# Altium project AgroRak_MK2.PrjPcb
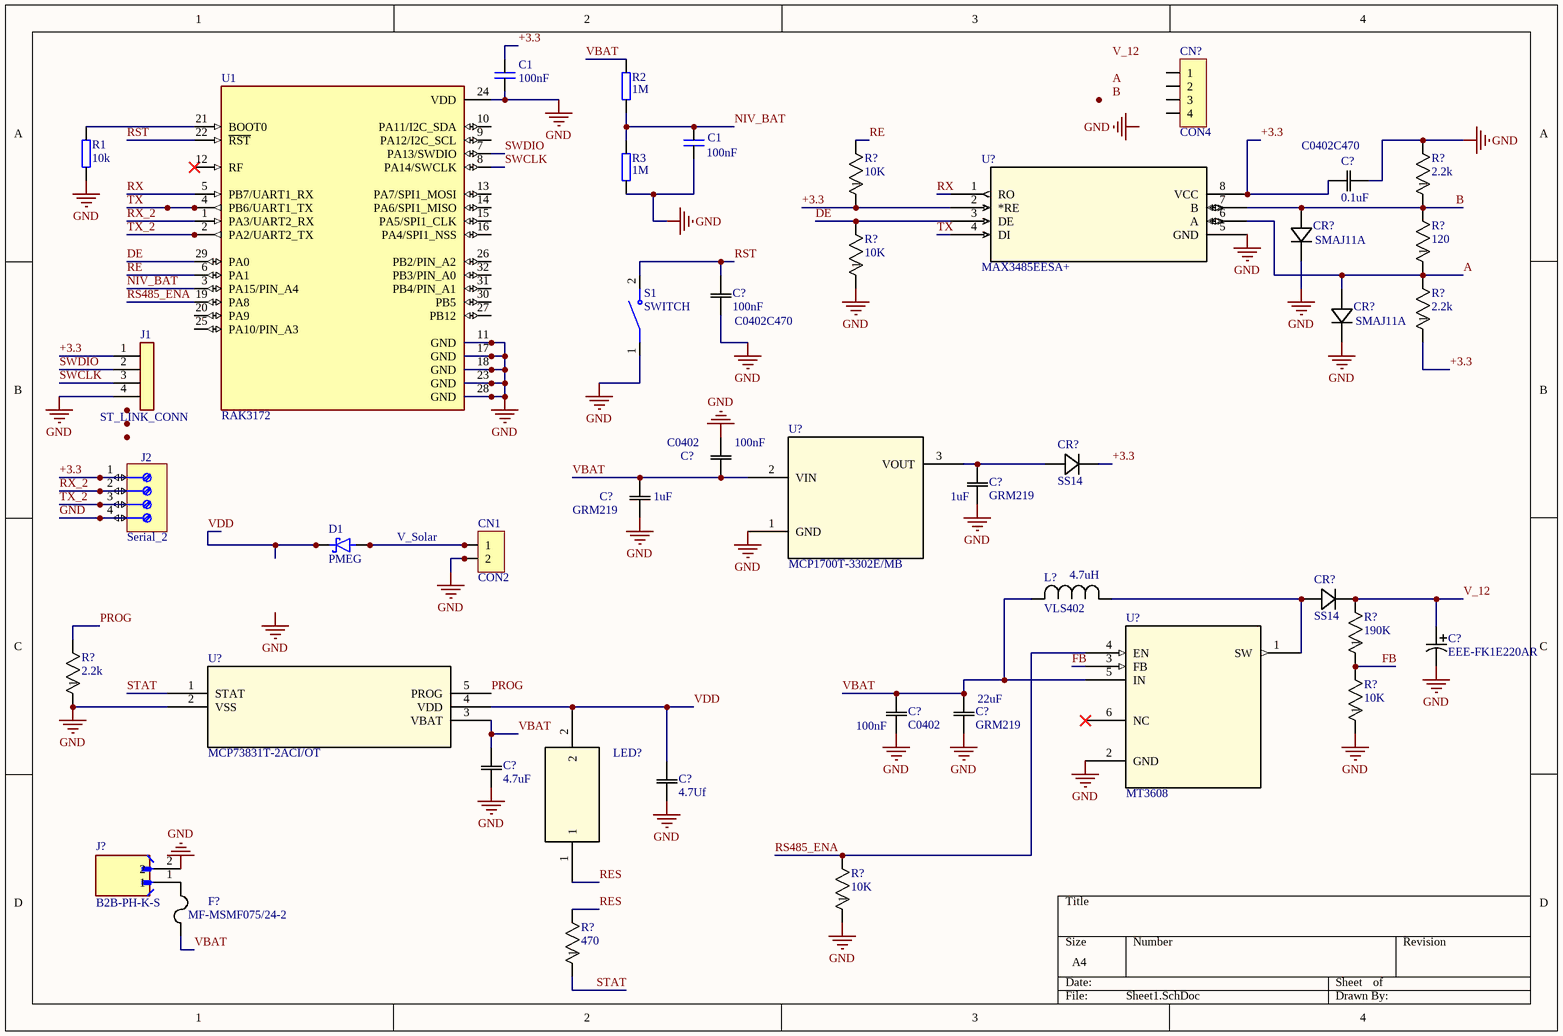
[diagram p0: Sheet1.SchDoc]
1 sheet, 44 parts. Net scope: global (net labels, ports and power ports of the same name join across sheets).
Board file: PCB1.PcbDoc

## Sheet Sheet1.SchDoc
size A4; SheetNumber: 1; SheetTotal: 1

### Parts
(Parts that share a designator on the sheet are numbered #1, #2 ... from top to bottom, then left to right.)
C1#1  (no value)  [CAPC2012X110N]
C1#2  (no value)  [CAPC2012X110N]
C?#1  0.1uF  [CAPC10555_55N_KEM]
C?#2  100nF  [CAPC10555_55N_KEM]
C?#3  C0402  [CAPC10555_55N_KEM]
C?#4  GRM219  [G-21_MUR]
C?#5  GRM219  [G-21_MUR]
C?#6  EEE-FK1E220AR  [CAP_EEFK_C_PAN]
C?#7  C0402  [CAPC10555_55N_KEM]
C?#8  GRM219  [G-21_MUR]
C?#9  4.7uF  [G-21_MUR]
C?#10  4.7Uf  [G-21_MUR]
CN1  CON2  [TRT2]
CN?  CON4  [TRT4]
CR?#1  (no value)  [SMASeries]
CR?#2  (no value)  [SMASeries]
CR?#3  SS14  [DIODE_DO214AC]
CR?#4  SS14  [DIODE_DO214AC]
D1  PMEG  [SODFL4725X110N]
F?  MF-MSMF075/24-2  [FUSE_MF-MSMF07524-2_BRN]
J1  ST_LINK_CONN  [PIN-HEADER-4-FEMALE]
J2  TRT4  [TRT4]  (value not drawn)
J?  B2B-PH-K-S  [JST_B2B-PH-K-S]
L?  VLS402  [IND_VLS4020CX_TDK]
LED?  (no value)  [LED0805N_CML]
R1  10k  [RESC2013X84N]
R2  1M  [RESC2013X84N]
R3  1M  [RESC2013X84N]
R?#1  10K  [RES_ERA2A_PAN]
R?#2  2.2k  [RES_ERA2A_PAN]
R?#3  120  [RES_ERA2A_PAN]
R?#4  10K  [RES_ERA2A_PAN]
R?#5  2.2k  [RES_ERA2A_PAN]
R?#6  190K  [RES_ERA2A_PAN]
R?#7  2.2k  [RES_ERA2A_PAN]
R?#8  10K  [RES_ERA2A_PAN]
R?#9  10K  [RES_ERA2A_PAN]
R?#10  470  [RES_ERA2A_PAN]
S1  SWITCH  [SWITCH-SMD-4x3mm]
U1  RAK3172  [XCVR_RAK3172]
U?#1  MAX3485EESA+  [21-0041B_8_MXM]
U?#2  MCP1700T-3302E/MB  [SOT-89_3MC_MCH]
U?#3  MT3608  [TSOT23-6SOT23-6_AER]
U?#4  MCP73831T-2ACI/OT  [SOT-223]

### Nets
GND: C1#1.2 C1#2.2 C?#1.1 C?#2.1 C?#3.2 C?#4.1 C?#5.1 C?#6.2 C?#7.1 C?#8.1 C?#9.1 C?#10.1 CN1.2 CR?#1.1 CR?#2.1 J1.4 J2.4 J?.2 R1.1 R3.1 R?#2.2 R?#4.1 R?#7.1 R?#8.1 R?#9.1 S1.1 U1.11(GND) U1.17(GND) U1.18(GND) U1.23(GND) U1.24(VDD) U1.28(GND) U?#1.5(GND) U?#2.1(GND) U?#3.2(GND) U?#4.2(VSS)
+3.3: C1#1.1 C?#1.2 CR?#3.1 J1.1 J2.1 R?#1.1 R?#5.1 U?#1.2(*RE) U?#1.8(VCC)
A: CR?#2.2 R?#3.1 R?#5.2 U?#1.6(A)
B: CR?#1.2 R?#2.1 R?#3.2 U?#1.7(B)
DE: R?#4.2 U1.29(PA0) U?#1.3(DE)
FB: R?#6.1 R?#8.2 U?#3.3(FB)
NIV_BAT: C1#2.1 R2.1 R3.2 U1.3(PA15/PIN_A4)
PROG: R?#7.2 U?#4.5(PROG)
RE: R?#1.2 U1.6(PA1)
RES: LED?.1 R?#10.2
RS485_ENA: R?#9.2 U1.19(PA8) U?#3.4(EN)
RST: C?#2.2 S1.2 U1.22(~{RST})
RX: U1.5(PB7/UART1_RX) U?#1.1(RO)
RX_2: J2.2 U1.1(PA3/UART2_RX)
STAT: R?#10.1 U?#4.1(STAT)
SWCLK: J1.3 U1.8(PA14/SWCLK)
SWDIO: J1.2 U1.7(PA13/SWDIO)
TX: U1.4(PB6/UART1_TX) U?#1.4(DI)
TX_2: J2.3 U1.2(PA2/UART2_TX)
V_12: C?#6.1 CR?#4.1 R?#6.2
VBAT: C?#3.1 C?#5.2 C?#7.2 C?#8.2 C?#9.2 F?.1 L?.2 R2.2 U?#2.2(VIN) U?#3.5(IN) U?#4.3(VBAT)
VDD: C?#10.2 D1.1(K) LED?.2 U?#4.4(VDD)
NetC?#4_2: C?#4.2 CR?#3.2 U?#2.3(VOUT)
NetCN1_1: CN1.1 D1.2(A)
NetCR?#4_2: CR?#4.2 L?.1 U?#3.1(SW)
NetF?_2: F?.2 J?.1
NetR1_2: R1.2 U1.21(BOOT0)

Not connected (* = marked no-connect by the designer): CN? 1 2 3 4; U1 9(PA12/I2C_SCL) 10(PA11/I2C_SDA) 12(RF)* 13(PA7/SPI1_MOSI) 14(PA6/SPI1_MISO) 15(PA5/SPI1_CLK) 16(PA4/SPI1_NSS) 20(PA9) 25(PA10/PIN_A3) 26(PB2/PIN_A2) 27(PB12) 30(PB5) 31(PB4/PIN_A1) 32(PB3/PIN_A0); U?#3 6(NC)*

### Notes on the sheet
- (near C1#1) 100nF
- (near C1#2) 100nF
- (near C?#1) C0402C470
- (near CR?#1) SMAJ11A
- (near C?#2) C0402C470
- (near CR?#2) SMAJ11A
- (near C?#3) 100nF
- (near C?#5) 1uF
- (near C?#4) 1uF
- (near J2) Serial_2
- V_Solar
- (near L?) 4.7uH
- (near C?#8) 22uF
- (near C?#7) 100nF
- Labels drawn without touching a wire or pin: A, B, GND, V_12

### Library data of the parts
C1#1 C1#2 = C0805C125K4RACTU: CAPACITOR, 0805; MF: KEMET; SnapEDA_Link: https://www.snapeda.com/parts/C0805C125K4RACTU/Kemet/view-part/?ref=snap; Package: 805-2 KEMET; Value: *; MP: C0805C125K4RACTU; Check_prices: https://www.snapeda.com/parts/C0805C125K4RACTU/Kemet/view-part/?ref=eda
C?#1-C?#3 C?#7 = C0402C470J5GACTU: SMD Comm C0G, Ceramic, 47 pF, 5%, 50 VDC, C0G, SMD, MLCC, Ultra-Stable, Low Loss, Class I, 0402; Manufacturer_Name: Kemet; Copyright: Copyright (C) 2026 Ultra Librarian. All rights reserved.; Manufacturer_Part_Number: C0402C470J5GACTU; Datasheet: https://content.kemet.com/datasheets/KEM_C1003_C0G_SMD.pdf
C?#4 C?#5 C?#8-C?#10 = GRM219R61A106KE44D: No Description Available; Manufacturer_Name: Murata; Copyright: Copyright (C) 2026 Ultra Librarian. All rights reserved.; Manufacturer_Part_Number: GRM219R61A106KE44D
C?#6 = EEE-FK1E220AR: No Description Available; Manufacturer_Name: Panasonic; Copyright: Copyright (C) 2026 Ultra Librarian. All rights reserved.; Manufacturer_Part_Number: EEE-FK1E220AR
CR?#1 CR?#2 = SMAJ11A: TVS unidireccional 11V; Manufacturer_Name: Bourns Electronics; Copyright: Copyright (C) 2025 Ultra Librarian. All rights reserved.; Manufacturer_Part_Number: SMAJ11A
CR?#3 CR?#4 = SS14: DIODE SCHOTTKY 40V 1A; Manufacturer_Name: Vishay; Copyright: Copyright (C) 2025 Ultra Librarian. All rights reserved.; Manufacturer_Part_Number: SS14
D1 = PMEG4020ETP,115: Diode Schottky 40V 2A Surface Mount SOD-128/CFP5; MF: Nexperia USA; SnapEDA_Link: https://www.snapeda.com/parts/PMEG4020ETP,115/Nexperia/view-part/?ref=snap; Package: CFP5-2 Nexperia USA Inc.; Value: *; MP: PMEG4020ETP,115; Check_prices: https://www.snapeda.com/parts/PMEG4020ETP,115/Nexperia/view-part/?ref=eda
F? = MF-MSMF07524-2: Fuse; Manufacturer_Name: Bourns Electronics; Copyright: Copyright (C) 2026 Ultra Librarian. All rights reserved.; Manufacturer_Part_Number: MF-MSMF075/24-2
J1 = PIN-HEADER-4: MP: MTSW-104-06-T-S-100; Price: None; Availability: Unavailable; Package: None; Value: *
J2 = TRT_4
J? = B2B-PH-K-S: Connector Header Through Hole 2 position 0.079 (2.00mm); MF: JST Sales America Inc.; SnapEDA_Link: https://www.snapeda.com/parts/B2B-PH-K-S/JST/view-part/?ref=snap; Package: None; Value: *; MP: B2B-PH-K-S; Check_prices: https://www.snapeda.com/parts/B2B-PH-K-S/JST/view-part/?ref=eda
L? = VLS4020CX-101M-H: Description; Manufacturer_Name: TDK; Type: Fixed Inductors; Copyright: Copyright (C) 2025 Ultra Librarian. All rights reserved.; Manufacturer_Part_Number: VLS4020CX-101M-H
LED? = CMD17-21VGCTR8: Description; Manufacturer_Name: VCC; Manufacturer_Part_Number: CMD17-21VGC/TR8; Copyright: Copyright (C) 2025 Ultra Librarian. All rights reserved.; RefDes: RefDes; Type: Type
R1-R3 = RES
R?#1-R?#10 = ERA-2ARB102X: Description; Manufacturer_Name: Panasonic; Copyright: Copyright (C) 2026 Ultra Librarian. All rights reserved.; Manufacturer_Part_Number: ERA-2ARB102X
S1 = SWITCH-SMD-4x3mm: 50mA 4mm 100MÎ© 100,000 Times 12V 160gf 3mm 2mm Round Button Vertical welding SPST SMD Tactile Switches ROHS; MF: Xunpu; MP: TS-1088-AR02016; SnapEDA_Link: https://www.snapeda.com/parts/TS-1088-AR02016/Xunpu/view-part/?ref=snap; Package: Package; Value: *; Check_prices: https://www.snapeda.com/parts/TS-1088-AR02016/Xunpu/view-part/?ref=eda
U1 = RAK3172: RAK3172 is a low-power long-range transceiver module based on the STM32WLE5CC chip. It provides an easy-to-use, small-size, low-power solution for long range wireless data applications; MF: Shenzhen RAKwireless Technology Co.,Ltd.; SnapEDA_Link: https://www.snapeda.com/parts/RAK3172/Shenzhen+RAKwireless+Technology+Co.%252CLtd./view-part/?ref=snap; Package: Package; Value: *; MP: RAK3172; Check_prices: https://www.snapeda.com/parts/RAK3172/Shenzhen+RAKwireless+Technology+Co.%252CLtd./view-part/?ref=eda
U?#1 = MAX3485EESA+: 3.3V Powered, Â±15kV ESD-Protected, 12Mbps, Slew-Rate-Limited True RS-485/RS-422 Transceivers; Manufacturer_Name: Analog Devices Inc; Copyright: Copyright (C) 2026 Ultra Librarian. All rights reserved.; Manufacturer_Part_Number: MAX3485EESA+; RefDes: RefDes; Type: Type
U?#2 = MCP1700T-3302EMB: Linear Voltage Regulators; Manufacturer_Name: Microchip; Copyright: Copyright (C) 2026 Ultra Librarian. All rights reserved.; Manufacturer_Part_Number: MCP1700T-3302E/MB; RefDes: RefDes; Type: Type
U?#3 = MT3608: DC-DC step-up; Manufacturer_Name: Aerosemi; Copyright: Copyright (C) 2025 Ultra Librarian. All rights reserved.; Manufacturer_Part_Number: MT3608; RefDes: RefDes; Type: Type
U?#4 = MCP73831T-2ACIOT: Series Single-Cell Li-Ion/Li-Polymer Battery Charge Controller; Manufacturer_Name: Microchip; Copyright: Copyright (C) 2025 Ultra Librarian. All rights reserved.; Manufacturer_Part_Number: MCP73831T-2ACI/OT; RefDes: RefDes; Type: Type